# EAGLE schematic Interrdigitated-Electrode-V1 (EAGLE 9.5.2)
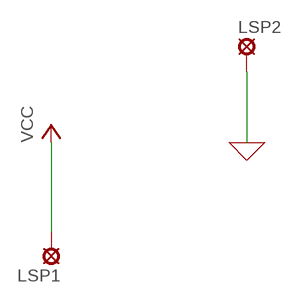
[diagram p0: schematic, sheet 1]

## Parts
LSP1  LSP10  [LSP10]
LSP2  LSP10  [LSP10]

## Nets
0: LSP2.MP ; supply symbol labelled GND
VCC: LSP1.MP

## Library data of the parts
LSP1 LSP2 = solpad:LSP10: SOLDER PAD drill 1.0 mm, distributor Buerklin, 12H555